# Altium schematic sheet Power.SchDoc
size A4
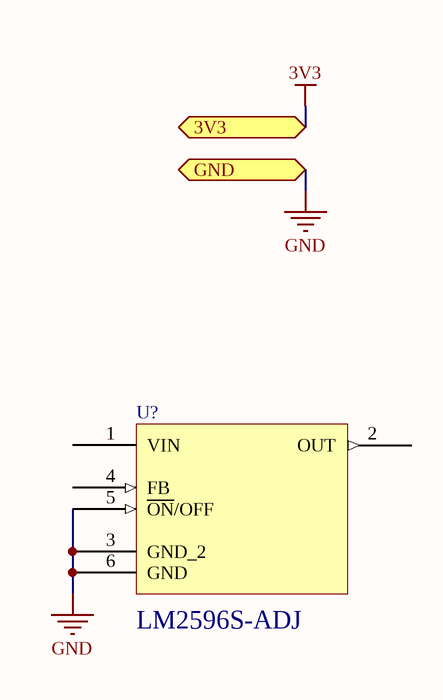
[diagram p0: Power.SchDoc]

## Parts
U?  LM2596S-ADJ  [TO170P1435X465-6N]

## Ports
3V3, GND

## Nets
3V3: port 3V3
GND: U?.3(GND_2) U?.5(~{ON}/OFF) U?.6(GND) ; port GND

Not connected (* = marked no-connect by the designer): U? 1(VIN) 2(OUT) 4(FB)

## Library data of the parts
U? = LM2596S-ADJ: MF: Texas; Availability: Unavailable; Package: TO-263-6 NEC; Price: None; SnapEDA_Link: https://www.snapeda.com/symbols-footprints/LM2596S-ADJ/Texas%20Instruments/view-part/?ref=snap; Value: *; MP: LM2596S-ADJ